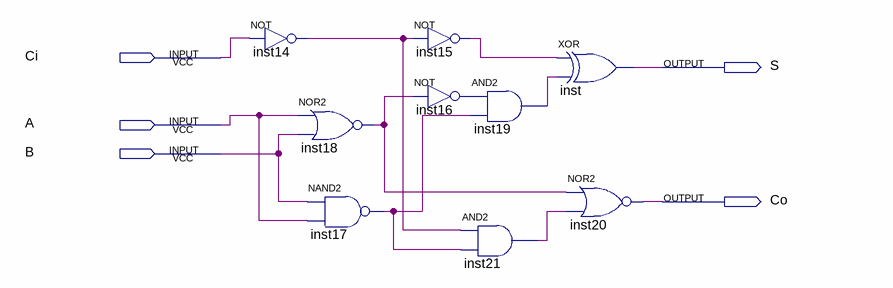
[diagram p0: schematic sheet]
// Quartus schematic SOMADOR1BITS.bdf as structural Verilog: 9 symbols, 5 pins
module SOMADOR1BITS (
  input  Ci,
  input  A,
  input  B,
  output S,
  output Co
);

  wire inst14_out, inst15_out, inst16_out, inst17_out, inst18_out, inst19_out, inst21_out;

  not inst14 (inst14_out, Ci);
  nor inst18 (inst18_out, A, B);
  nand inst17 (inst17_out, B, A);
  not inst15 (inst15_out, inst14_out);
  and inst19 (inst19_out, inst16_out, inst17_out);
  not inst16 (inst16_out, inst18_out);
  and inst21 (inst21_out, inst14_out, inst17_out);
  xor inst (S, inst15_out, inst19_out);
  nor inst20 (Co, inst18_out, inst21_out);
endmodule
